# Altium schematic sheet Sheet1.SchDoc
size A4
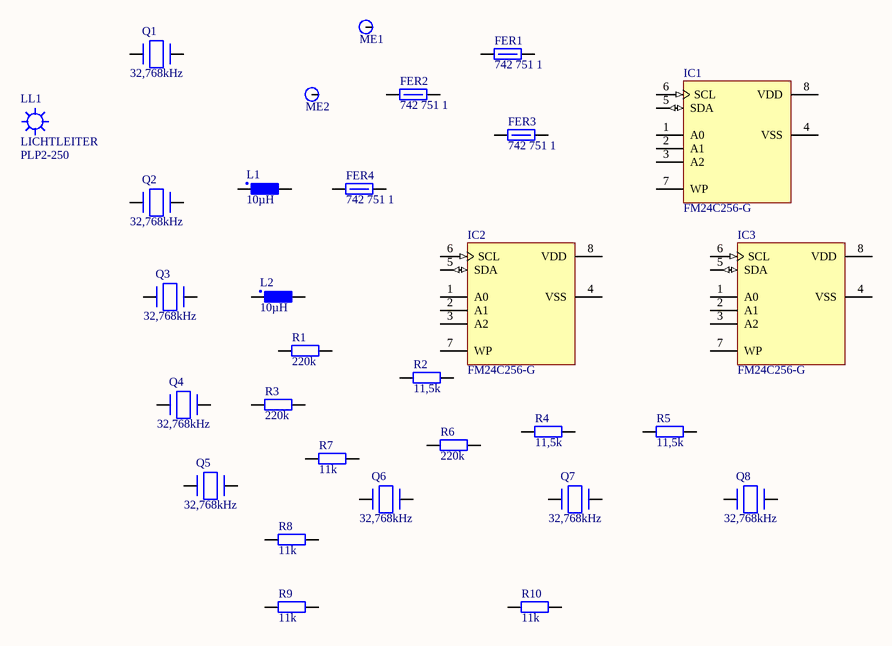
[diagram p0: Sheet1.SchDoc]

## Parts
FER1  ValueA: 742 751 1  [IND_WE-SUKW]  (hidden comment: FERRITE)
FER2  ValueA: 742 751 1  [IND_WE-SUKW]  (hidden comment: FERRITE)
FER3  ValueA: 742 751 1  [IND_WE-SUKW]  (hidden comment: FERRITE)
FER4  ValueA: 742 751 1  [IND_WE-SUKW]  (hidden comment: FERRITE)
IC1  ValueA: FM24C256-G  [SOIC127P600X175-8]  (hidden comment: MEMORY_I2C-FLASH_8PIN)
IC2  ValueA: FM24C256-G  [SOIC127P600X175-8]  (hidden comment: MEMORY_I2C-FLASH_8PIN)
IC3  ValueA: FM24C256-G  [SOIC127P600X175-8]  (hidden comment: MEMORY_I2C-FLASH_8PIN)
L1  ValueA: 10µH  [INDC2012N]  (hidden comment: INDUCTOR)
L2  ValueA: 10µH  [INDC2012N]  (hidden comment: INDUCTOR)
LL1  LICHTLEITER  ValueA: PLP2-250  (mechanical)
ME1  BEFESTIGUNGSPAD  [HOLE-3.5MM-10MM-TOP-PAD]  (value not drawn)  (no BOM)
ME2  BEFESTIGUNGSPAD  [HOLE-3.5MM-10MM-TOP-PAD]  (value not drawn)  (no BOM)
Q1  ValueA: 32,768kHz  [QUARZ_CM315]  (hidden comment: XTAL_2PINS_1+2)
Q2  ValueA: 32,768kHz  [QUARZ_CM315]  (hidden comment: XTAL_2PINS_1+2)
Q3  ValueA: 32,768kHz  [QUARZ_CM315]  (hidden comment: XTAL_2PINS_1+2)
Q4  ValueA: 32,768kHz  [QUARZ_CM315]  (hidden comment: XTAL_2PINS_1+2)
Q5  ValueA: 32,768kHz  [QUARZ_CM315]  (hidden comment: XTAL_2PINS_1+2)
Q6  ValueA: 32,768kHz  [QUARZ_CM315]  (hidden comment: XTAL_2PINS_1+2)
Q7  ValueA: 32,768kHz  [QUARZ_CM315]  (hidden comment: XTAL_2PINS_1+2)
Q8  ValueA: 32,768kHz  [QUARZ_CM315]  (hidden comment: XTAL_2PINS_1+2)
R1  ValueA: 220k  [RESC1608N]  (hidden comment: RES)
R2  ValueA: 11,5k  [RESC1005N]  (hidden comment: RES)
R3  ValueA: 220k  [RESC1608N]  (hidden comment: RES)
R4  ValueA: 11,5k  [RESC1005N]  (hidden comment: RES)
R5  ValueA: 11,5k  [RESC1005N]  (hidden comment: RES)
R6  ValueA: 220k  [RESC1608N]  (hidden comment: RES)
R7  ValueA: 11k  [RESC1005N]  (hidden comment: RES)
R8  ValueA: 11k  [RESC1005N]  (hidden comment: RES)
R9  ValueA: 11k  [RESC1005N]  (hidden comment: RES)
R10  ValueA: 11k  [RESC1005N]  (hidden comment: RES)

## Nets

Not connected (* = marked no-connect by the designer): FER1 1 2; FER2 1 2; FER3 1 2; FER4 1 2; IC1 1(A0) 2(A1) 3(A2) 4(VSS) 5(SDA) 6(SCL) 7(WP) 8(VDD); IC2 1(A0) 2(A1) 3(A2) 4(VSS) 5(SDA) 6(SCL) 7(WP) 8(VDD); IC3 1(A0) 2(A1) 3(A2) 4(VSS) 5(SDA) 6(SCL) 7(WP) 8(VDD); L1 1 2; L2 1 2; ME1 1; ME2 1; Q1 1 2; Q2 1 2; Q3 1 2; Q4 1 2; Q5 1 2; Q6 1 2; Q7 1 2; Q8 1 2; R1 1 2; R2 1 2; R3 1 2; R4 1 2; R5 1 2; R6 1 2; R7 1 2; R8 1 2; R9 1 2; R10 1 2

## Library data of the parts
FER1-FER4 = HA7427511-S22: Filter, 742 751 1 (Würth), 2 pol SMT, Ferritperle, Imax=5A, 416R; ValueB: 5A; CreatedByOn: gope/2015-11-04; CheckedByOn: lith/2015-11-04; Ident: HA7427511-S22; ArticleGroup: Filter; HelpURL: http://katalog.we-online.de/pbs/datasheet/7427511.pdf; ComponentLink1Description: Datasheet 1; ComponentLink1URL: http://katalog.we-online.de/pbs/datasheet/7427511.pdf; ComponentLink2Description: Datasheet 2; ComponentLink2URL: http://katalog.we-online.de/de/pbs/WE-SUKW/7427511?m=n&sp=http%3A%2F%2Fwww.we-online.de%2Fweb%2Fde%2Fwuerth_elektronik%2Fsearchpage.php%3Fsearch%3D742%2B751%2B1
IC1-IC3 = IC24C256-S30: IC, FM24C256-G (Cypress) / FM24C256-SE, SO8, Serial FRAM, 32Kx8, 5V; CreatedByOn: lith/2015-11-30; CheckedByOn: gope/2015-12-01; Ident: IC24C256-S30; ArticleGroup: IC; HelpURL: http://www.kosmodrom.com.ua/data/memory/FM24C256ds_r3.1.pdf; ComponentLink1Description: Datasheet 1; ComponentLink1URL: http://www.kosmodrom.com.ua/data/memory/FM24C256ds_r3.1.pdf; ComponentLink2Description: Datasheet 2; ComponentLink2URL: http://www.cypress.com/file/125096/download; ComponentLink3Description: Datasheet 3; ComponentLink3URL: http://www.cypress.com/file/136451/download
L1 L2 = PAIMZL2012-S10: Induktivität, MLZ2012E100MT (TDK Epson), 0805, 10µH; ValueB: 0805, MLZ2012E100MT; CreatedByOn: gope/2015-02-12; CheckedByOn: lith/2015-02-12; Ident: PAIMZL2012-S10; ArticleGroup: Induktivität; HelpURL: http://www.farnell.com/datasheets/1649095.pdf; ComponentLink1Description: Datasheet 1; ComponentLink1URL: http://www.farnell.com/datasheets/1649095.pdf
LL1 = MEPLP2-K10: Montagematerial, PLP2-250 (Bivar) / 63.64.521 , Lichtleiter, L=6,4mm, d=2,8mm, transparent, PC; CreatedByOn: lith/2015-10-27; CheckedByOn: frka/2015-10-28; Ident: MEPLP2-K10; ArticleGroup: Montagematerial; HelpURL: http://www.bivar.com/Portals/0/Products/d.ashx?f=%2fPortals%2f0%2fproducts%2fPLP2-XXX.pdf; ComponentLink1Description: Datasheet 1; ComponentLink1URL: http://www.bivar.com/Portals/0/Products/d.ashx?f=%2fPortals%2f0%2fproducts%2fPLP2-XXX.pdf; ComponentLink2Description: Datasheet 2; ComponentLink2URL: http://www.bivar.com/led-indication/light-pipes/rigid/vertical-press-fit-mount/plp2?p=PLP2-250
ME1 ME2 = AD-HOLE-3.5: Befestigungsbohrung 3.5mm; ArticleGroup: Altium Designer Element; CreatedByOn: gope/2015-02-23; CheckedByOn: frka/2015-02-24; Ident: AD-HOLE-3.5
Q1-Q8 = HANX3215SA-S11: Quarz, NX3215SA-32.768K-STD-MUA-14 (NDK), 2 pol SMT, Quarz, 32,768kHz, Cl=6pF, 20ppm, -40°C bis 85°C; ValueB: 2 pol SMT, NX3215SA-32.768K-STD-MUA-14, Quarz; CreatedByOn: frka/2015-01-30; CheckedByOn: gope/2015-02-09; Ident: HANX3215SA-S11; ArticleGroup: Quarz; HelpURL: http://www.ndk.com/images/products/catalog/c_NX3215SA-STD-MUA-9_e.pdf; ComponentLink1Description: Datasheet 1; ComponentLink1URL: http://www.ndk.com/images/products/catalog/c_NX3215SA-STD-MUA-9_e.pdf
R1 R3 R6 = WI2203-S16: Widerstand, 0603, 220k, 1%, Metall, Chip, TK100; ValueB: 0603, 1%, TK100; CreatedByOn: lith/2015-01-08; CheckedByOn: frka/2015-02-16; Ident: WI2203-S16; ArticleGroup: Widerstand
R2 R4 R5 = WI1156-S10: Widerstand, 0402, 11,5k, 1%, Metall, Chip, TK100; ValueB: 0402, 1%, TK100; CreatedByOn: lith/2015-01-09; CheckedByOn: frka/2015-02-16; Ident: WI1156-S10; ArticleGroup: Widerstand
R7-R10 = WI1102-S14: Widerstand, 0402, 11k, 1%, Metall, Chip, TK100; ValueB: 0402, 1%, TK100; CreatedByOn: lith/2015-01-09; CheckedByOn: frka/2015-02-16; Ident: WI1102-S14; ArticleGroup: Widerstand